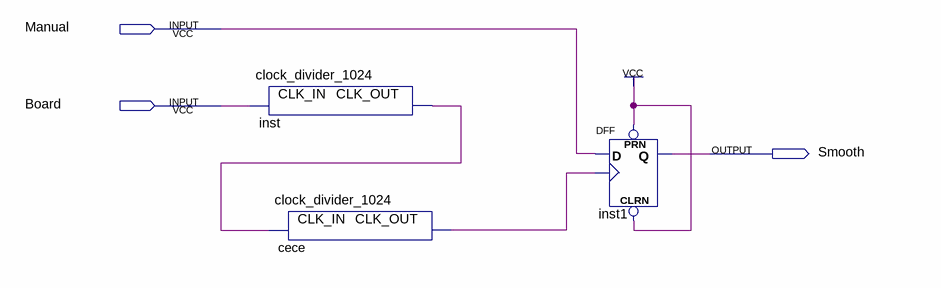
[diagram p0: schematic sheet]
// Quartus schematic lab11step3.bdf as structural Verilog: 3 symbols, 3 pins
module lab11step3 (
  input  Manual,
  input  Board,
  output Smooth
);

  wire cece_clk_out, inst_clk_out;

  clock_divider_1024 inst (.CLK_IN(Board), .CLK_OUT(inst_clk_out));
  clock_divider_1024 cece (.CLK_IN(inst_clk_out), .CLK_OUT(cece_clk_out));
  DFF inst1 (.CLRN(1'b1), .CLK(cece_clk_out), .D(Manual), .PRN(1'b1), .Q(Smooth));
endmodule
